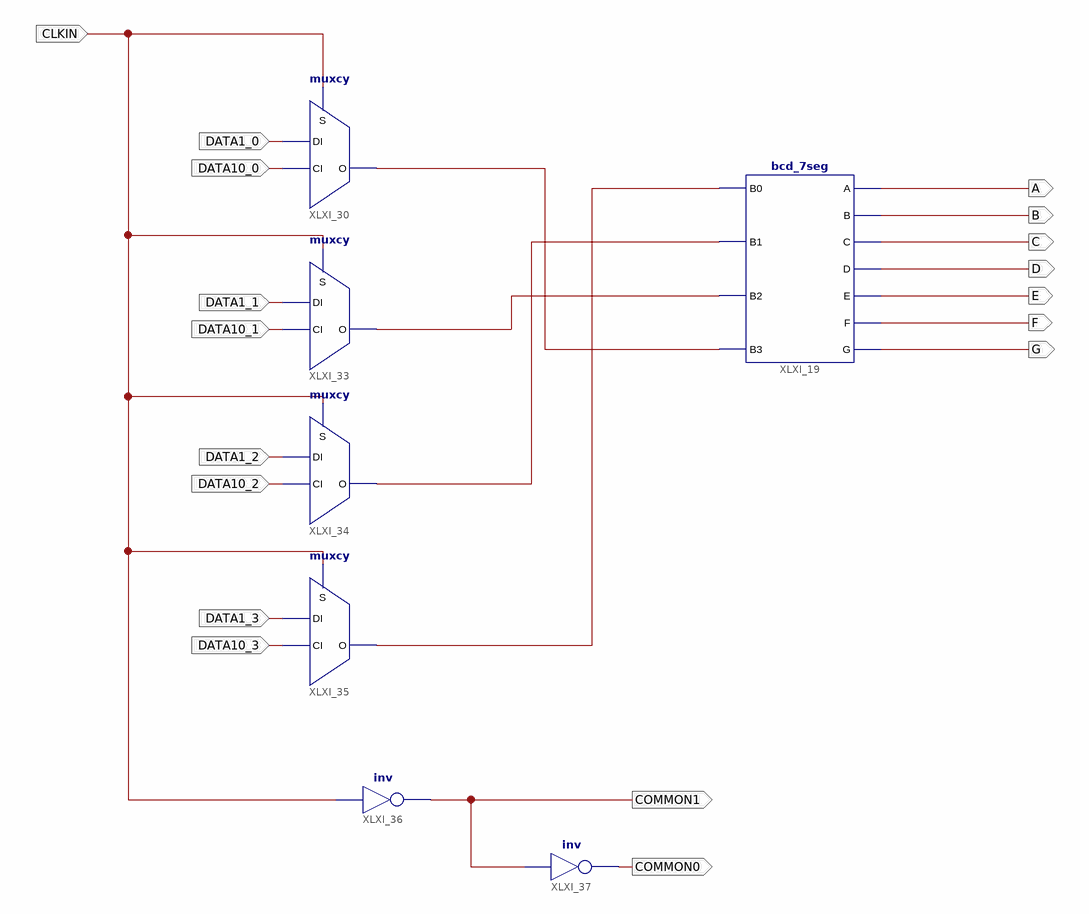
[diagram p0: schematic sheet 1]
// Xilinx ISE schematic Display.sch (spartan6) as structural Verilog: 7 symbols, 18 ports
module Display (
  input  CLKIN,
  input  DATA1_0,
  input  DATA10_0,
  input  DATA1_1,
  input  DATA10_1,
  input  DATA1_2,
  input  DATA10_2,
  input  DATA1_3,
  input  DATA10_3,
  output A,
  output B,
  output C,
  output D,
  output E,
  output F,
  output G,
  output COMMON1,
  output COMMON0
);

  wire XLXN_66, XLXN_67, XLXN_68, XLXN_69;

  bcd_7seg XLXI_19 (
    .B0(XLXN_69), .B1(XLXN_68), .B2(XLXN_67), .B3(XLXN_66), .A(A), .B(B), .C(C), .D(D), .E(E), .F(F), .G(G));
  muxcy XLXI_30 (.CI(DATA10_0), .DI(DATA1_0), .S(CLKIN), .O(XLXN_66));
  muxcy XLXI_33 (.CI(DATA10_1), .DI(DATA1_1), .S(CLKIN), .O(XLXN_67));
  muxcy XLXI_34 (.CI(DATA10_2), .DI(DATA1_2), .S(CLKIN), .O(XLXN_68));
  muxcy XLXI_35 (.CI(DATA10_3), .DI(DATA1_3), .S(CLKIN), .O(XLXN_69));
  not XLXI_36 (COMMON1, CLKIN);
  not XLXI_37 (COMMON0, COMMON1);
endmodule
